# EAGLE design analog-out-and-pwr-amp (EAGLE 6.5.0)
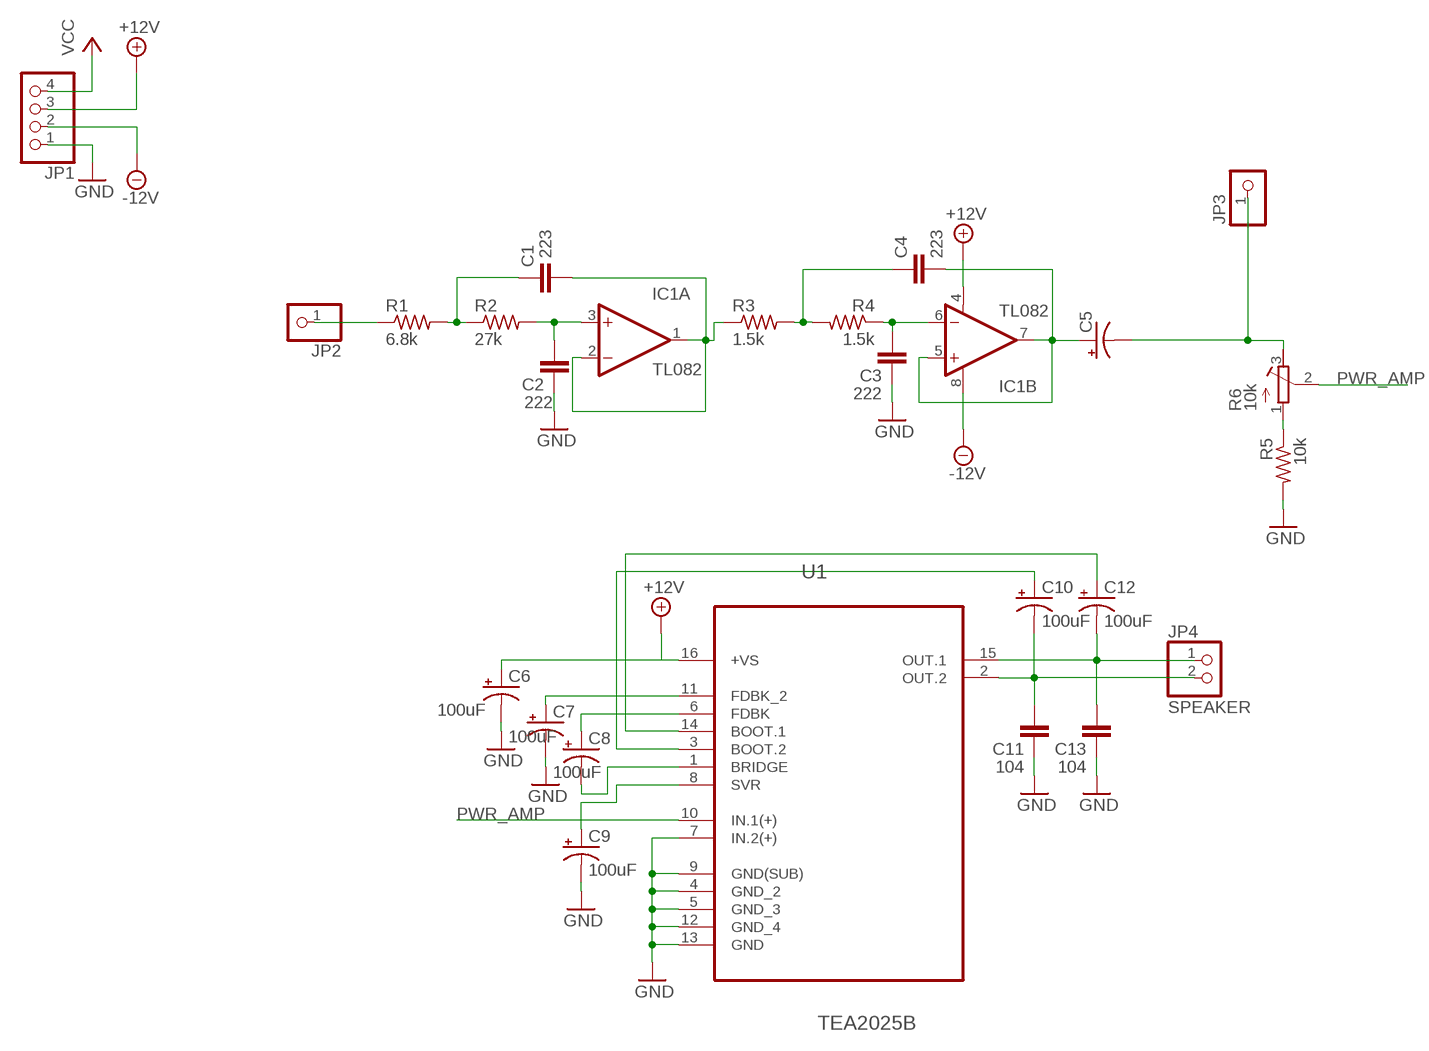
[diagram p0: schematic, sheet 1]

## Parts
C1  223  C-EUCERAMIC-CAP-COMMON  [C025-060X050]
C2  222  C-EUCERAMIC-CAP-COMMON  [C025-060X050]
C3  222  C-EUCERAMIC-CAP-COMMON  [C025-060X050]
C4  223  C-EUCERAMIC-CAP-COMMON  [C025-060X050]
C5  CPOL-USSANYO_D  [POL-CAP-COMMON]
C6  100uF  CPOL-USSANYO_D  [POL-CAP-COMMON]
C7  100uF  CPOL-USSANYO_D  [POL-CAP-COMMON]
C8  100uF  CPOL-USSANYO_D  [POL-CAP-COMMON]
C9  100uF  CPOL-USSANYO_D  [POL-CAP-COMMON]
C10  100uF  CPOL-USSANYO_D  [POL-CAP-COMMON]
C11  104  C-EUCERAMIC-CAP-COMMON  [C025-060X050]
C12  100uF  CPOL-USSANYO_D  [POL-CAP-COMMON]
C13  104  C-EUCERAMIC-CAP-COMMON  [C025-060X050]
IC1  TL082  [DIP08]
JP1  PINHD-1X4  [1X04]
JP2  PINHD-1X1  [1X01]
JP3  PINHD-1X1  [1X01]
JP4  SPEAKER  PINHD-1X20.5"  [1X02/0.5"]
R1  6.8k  R-US_0207/10  [R-US-COMMON]
R2  27k  R-US_0207/10  [R-US-COMMON]
R3  1.5k  R-US_0207/10  [R-US-COMMON]
R4  1.5k  R-US_0207/10  [R-US-COMMON]
R5  10k  R-US_0207/10  [R-US-COMMON]
R6  10k  R-TRIMM64W  [RTRIM-COMMON]
U1  TEA2025B  [DIP254P762X510-16]

## Nets
+12V: C6.+ IC1.4(B:V-) JP1.3 U1.16(+VS)
-12V: IC1.8(B:V+) JP1.2
GND: C2.1 C3.1 C6.- C7.- C9.- C11.1 C13.1 JP1.1 R5.2 U1.4(GND_2) U1.5(GND_3) U1.7(IN.2(+)) U1.9(GND(SUB)) U1.12(GND_4) U1.13(GND)
N$1: C4.2 C5.+ IC1.5(B:+IN) IC1.7(B:OUT)
N$2: JP2.1 R1.1
N$3: R5.1 R6.1(A)
N$4: C1.1 R1.2 R2.1
N$5: C2.2 IC1.3(A:+IN) R2.2
N$6: C1.2 IC1.1(A:OUT) IC1.2(A:-IN) R3.1
N$7: C4.1 R3.2 R4.2
N$8: C3.2 IC1.6(B:-IN) R4.1
N$9: C5.- JP3.1 R6.3(E)
N$10: C7.+ U1.11(FDBK_2)
N$11: C8.+ U1.6(FDBK)
N$12: C8.- U1.1(BRIDGE)
N$13: C12.- C13.2 JP4.1 U1.15(OUT.1)
N$14: C12.+ U1.14(BOOT.1)
N$15: C10.- C11.2 JP4.2 U1.2(OUT.2)
N$16: C10.+ U1.3(BOOT.2)
N$17: C9.+ U1.8(SVR)
PWR_AMP: R6.2(S) U1.10(IN.1(+))
VCC: JP1.4

## Library data of the parts
C1-C4 C11 C13 = datle-discrete:C-EU: CAPACITOR, European symbol
C5-C10 C12 = datle-discrete:CPOL-US: POLARIZED CAPACITOR, American symbol
IC1 = datle-analogic:TL082
JP1 = pinhead:PINHD-1X4: PIN HEADER
JP2 JP3 = datle-conn:PINHD-1X1: PIN HEADER
JP4 = datle-conn:PINHD-1X2: PIN HEADER
R1-R5 = datle-discrete:R-US_: RESISTOR, American symbol
R6 = datle-discrete:R-TRIMM: Trimm resistor
U1 = datle-analogic:TEA2025B: STREO AUDIO AMPLIFIER; MPN: TEA2025B; OC_FARNELL: 1263004; OC_NEWARK: 89K1062; PACKAGE: PDIP-16; SUPPLIER: STMICROELECTRONICS

## Board
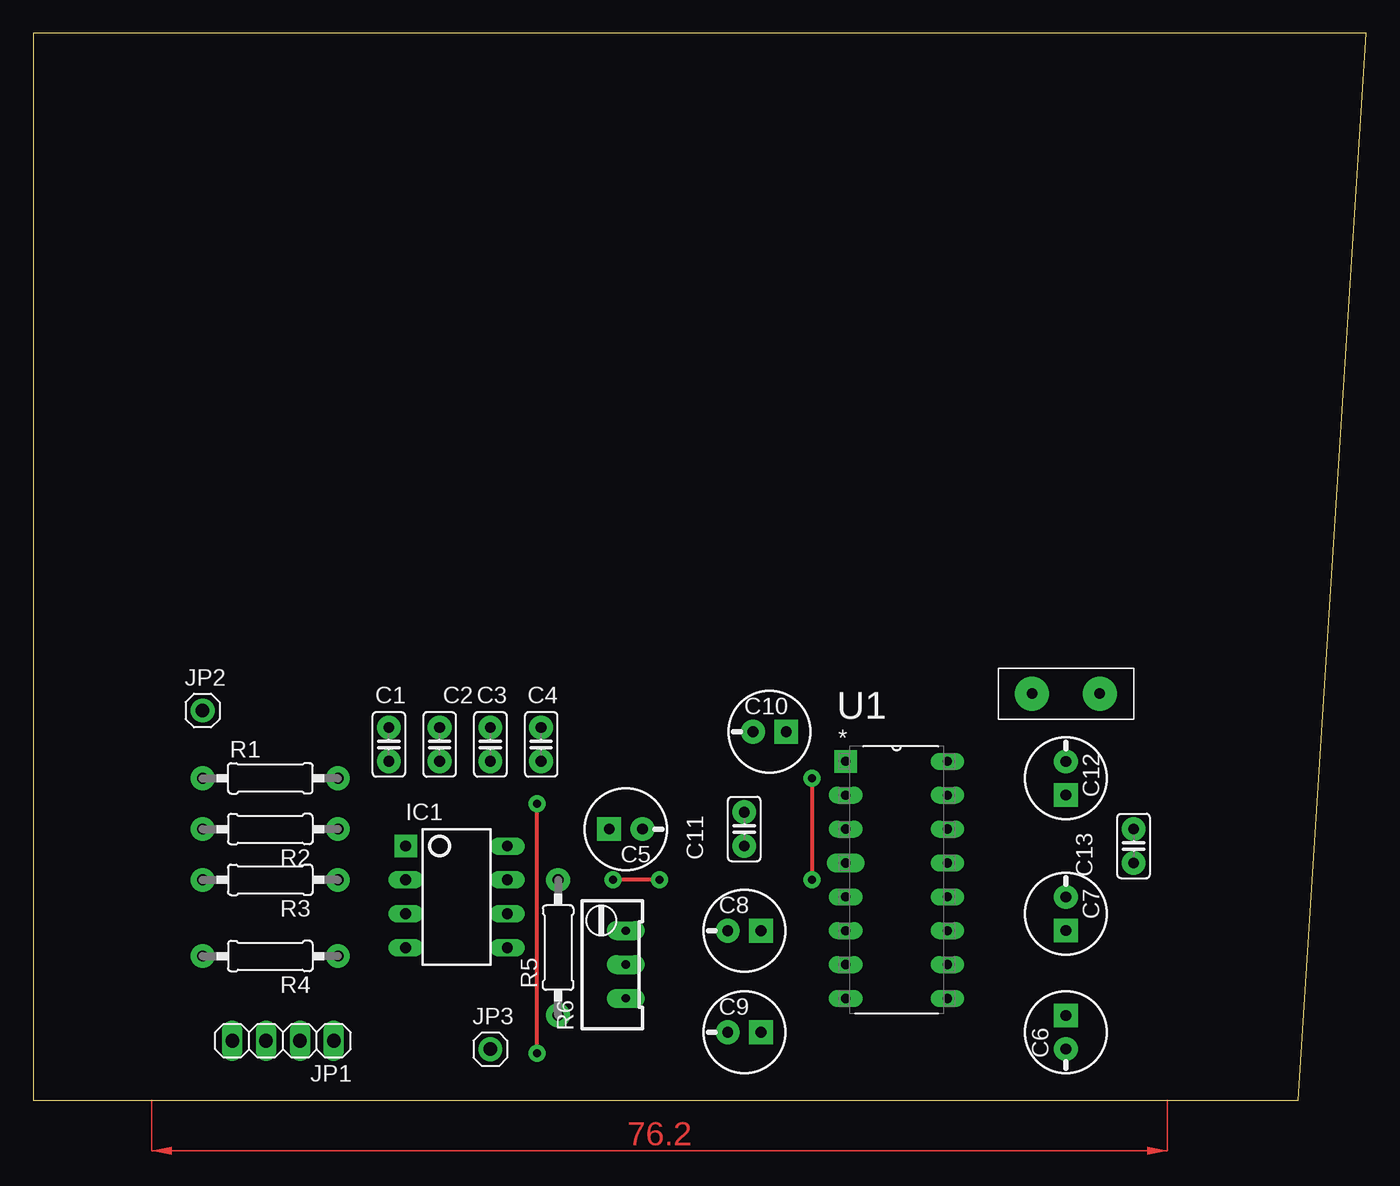
[diagram p1: board, top side]
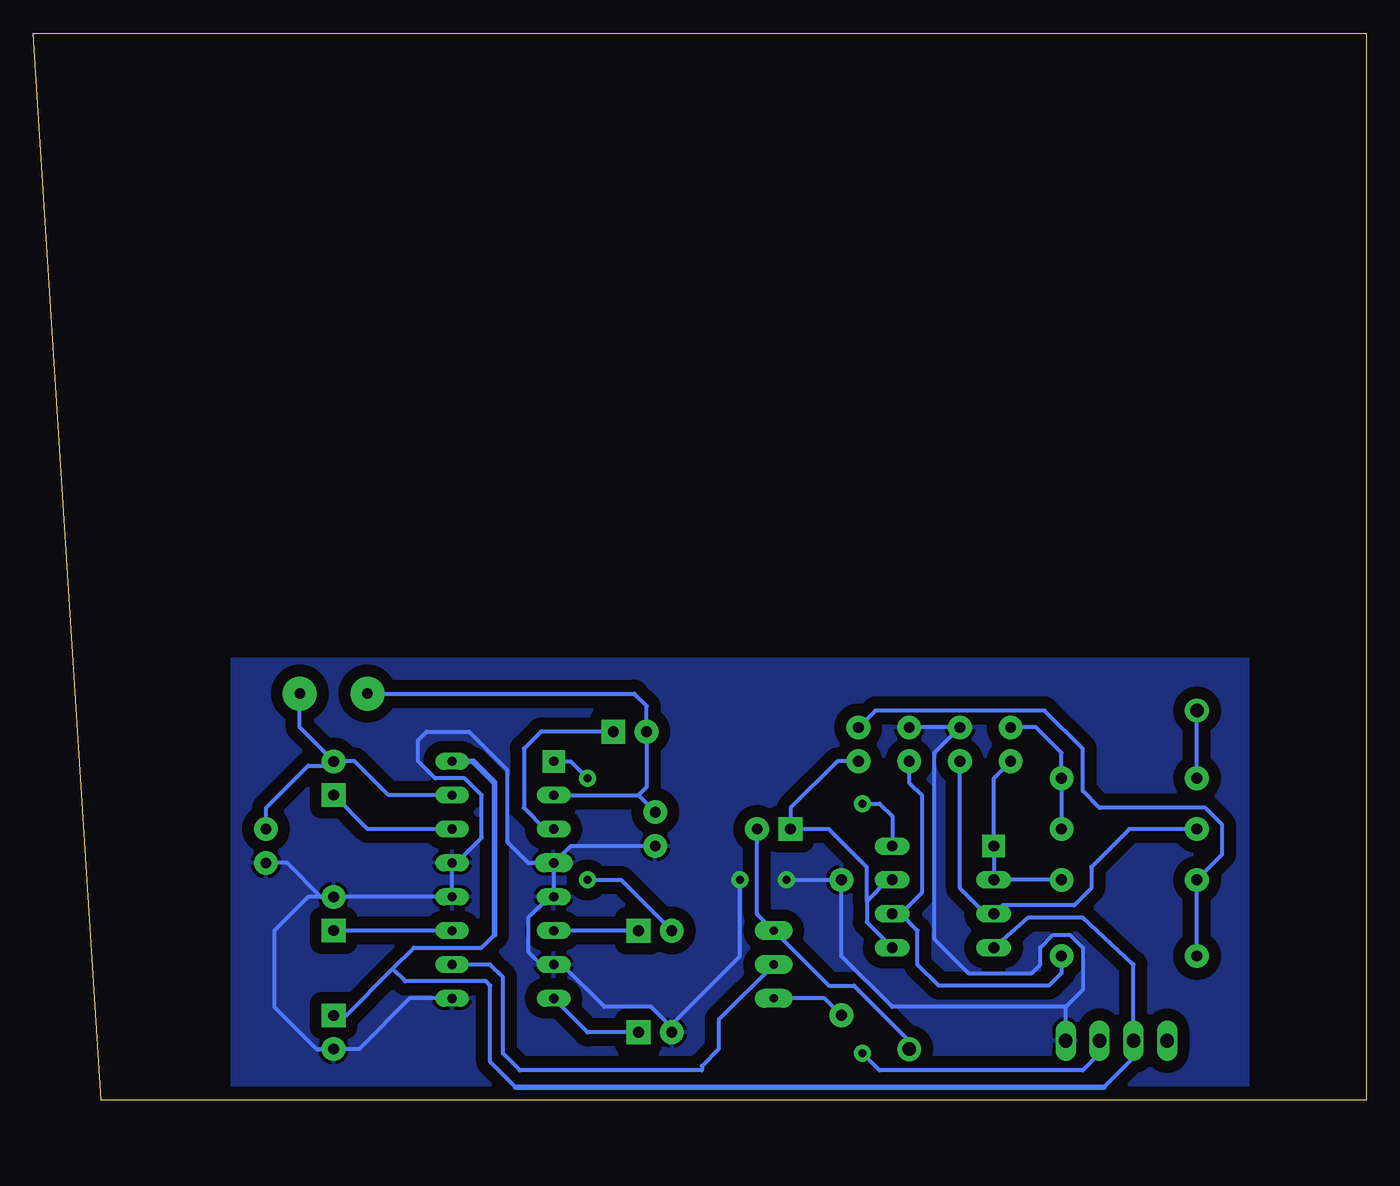
[diagram p2: board, bottom side, seen from below]

Size 100 x 80 mm. Coordinates in mm from the lower left corner, seen from the top.
Outline: 0,0 94.92,0 100,80 0,80 0,0
Copper layers (1*16): Top 0.035mm / dielectric 1.5mm / Bottom 0.035mm
Design rules "default": minimum track width 10mil, minimum drill 24mil, track to track 8mil, track to pad 8mil, pad to pad 8mil, via to via 8mil, smd to smd 8mil, copper to edge 40mil, drill to drill 8mil, minimum pad ring 10mil, minimum via ring 8mil, stop-mask expansion 4mil, vias tented up to drill 0mil, thermal gap 10mil

### Footprints (pad centres in the part's own frame; a part is rotated, then mirrored left to right if it is on the bottom)
C025-060X050 = drill 0.813 pad 1.778: 1 -1.27,0; 2 1.27,0
POL-CAP-COMMON = drill 0.8 pad 1.778 square: + 1.25,0 | drill 0.8 pad 1.778: - -1.25,0
DIP08 = drill 0.813 pad 1.676 square: 1 -3.81,-3.81 | drill 0.813 pad 1.27 long: 2 -1.27,-3.81; 3 1.27,-3.81; 4 3.81,-3.81; 5 3.81,3.81; 6 1.27,3.81; 7 -1.27,3.81; 8 -3.81,3.81
1X04 = drill 1.016 long: 1 -3.81,0; 2 -1.27,0; 3 1.27,0; 4 3.81,0
1X01 = drill 1.016 pad 1.778: 1 0,0
1X02/0.5" = drill 0.8 pad 2.54: 1 -3.81,0; 2 1.27,0
R-US-COMMON = drill 0.813 pad 1.778: 1 -5.08,0; 2 5.08,0
RTRIM-COMMON = drill 0.61 pad 1.422 long: 1 1.27,-2.54; 2 1.27,0; 3 1.27,2.54
DIP254P762X510-16 = drill 0.7 pad 1.676 square: 1 -7.62,17.78 | drill 0.7 pad 1.27 long: 2 -7.62,15.24; 3 -7.62,12.7; 5 -7.62,7.62; 6 -7.62,5.08; 7 -7.62,2.54; 8 -7.62,0; 9 0,0; 10 0,2.54; 11 0,5.08; 12 0,7.62; 13 0,10.16; 14 0,12.7; 15 0,15.24; 16 0,17.78 | drill 0.7 pad 1.422 long: 4 -7.62,10.16

### Placement (x,y rotation side)
C1  26.67,26.67 270 top
C2  30.48,26.67 270 top
C3  34.29,26.67 270 top
C4  38.1,26.67 270 top
C5  44.45,20.32 180 top
C6  77.47,5.08 90 top
C7  77.47,13.97 270 top
C8  53.34,12.7 0 top
C9  53.34,5.08 0 top
C10  55.24,27.62 0 top
C11  53.34,20.32 90 top
C12  77.47,24.13 270 top
C13  82.55,19.05 90 top
IC1  31.75,15.24 270 top
JP1  18.73,4.45 180 top
JP2  12.7,29.21 0 top
JP3  34.29,3.81 0 top
JP4  76.2,30.48 180 top
R1  17.78,24.13 0 top
R2  17.78,20.32 180 top
R3  17.78,16.51 180 top
R4  17.78,10.79 180 top
R5  39.37,11.43 90 top
R6  43.18,10.16 0 top
U1  68.58,7.62 0 top

### Tracks (layer width: path | path; a pad name or v marks a point on that pad's centre or on a via)
+12V
  Bottom 0.305: C6.+ 76.54,6.33 73.03,9.84 | 73.03,9.84 71.44,11.43 66.36,11.43 65.41,12.38 | 19.68,0.95 17.46,3.17 JP1.3 17.46,10.16 21.27,13.65 25.4,13.65 IC1.4 | 63.82,0.95 65.72,2.86 65.72,8.57 66.04,8.89 72.07,8.89 73.03,9.84
  Bottom 0.406: 65.41,12.38 65.41,23.81 66.99,25.4 U1.16 | 19.68,0.95 63.82,0.95
-12V  (via drill 0.6 pad 1.27)
  Top 0.305: v37.78,3.49 v37.78,22.23
  Bottom 0.305: JP1.2 20,3.49 21.27,2.22 36.51,2.22 v37.78,3.49 | v37.78,22.23 36.51,22.23 35.56,21.27 IC1.8
GND  (via drill 0.6 pad 1.27)
  Top 0.305: v46.99,16.51 v43.5,16.51
  Bottom 0.305: C3.1 C2.1 32.38,26.04 32.38,12.06 29.84,9.53 25.08,9.53 24.45,10.16 24.45,11.43 23.5,12.38 22.23,12.38 21.27,11.43 21.27,8.26 22.54,6.99 | C9.- 52.09,5.42 | 52.09,5.42 53.66,6.99 57.15,6.99 60.33,10.16 U1.7 61.91,10.16 62.87,11.11 62.87,13.65 61.28,15.24 U1.5 U1.4 | 52.09,5.42 52.09,5.7 46.99,10.79 v46.99,16.51 | C11.1 59.69,19.05 U1.4 | U1.12 U1.13 | U1.9 71.75,7.62 75.56,3.81 77.45,3.81 C6.- 77.49,3.81 78.74,3.81 81.92,6.99 81.92,12.7 79.38,15.24 U1.12 | U1.12 77.45,15.24 C7.- 78.4,15.22 80.96,17.78 C13.1 | U1.12 68.58,17.46 66.36,19.68 66.36,22.86 67.63,24.13 69.85,24.13 71.12,25.4 71.12,26.99 70.48,27.62 67.31,27.62 64.45,24.77 64.45,19.37 62.87,17.78 U1.4 | 22.54,6.99 35.56,6.99 39.37,10.79 R5.2 v43.5,16.51 | JP1.1 22.54,6.99
  pour Bottom (isolate 0.889): 8.89,0 8.89,33.02 85.09,33.02 85.09,0
N$1
  Bottom 0.305: IC1.7 35.88,16.51 37.47,14.92 | 37.47,14.92 37.47,13.34 IC1.5 | 37.47,14.92 37.47,17.46 40.32,20.32 C5.+ 43.18,20.34 43.18,21.91 39.69,25.4 C4.2
N$2
  Bottom 0.305: R1.1 JP2.1
N$3
  Bottom 0.305: R5.1 40.64,7.62 R6.1
N$4
  Bottom 0.305: R2.1 R1.2 22.86,26.04 24.77,27.94 C1.1
N$5
  Bottom 0.305: R2.2 17.78,20.32 20.64,17.46 20.64,15.88 21.91,14.61 27.3,14.61 IC1.3 28.57,13.97 30.48,15.88 C2.2
N$6
  Bottom 0.305: R3.1 IC1.2 IC1.1 27.94,24.13 C1.2
N$7
  Bottom 0.305: R4.2 R3.2 10.79,18.41 10.79,20.64 12.06,21.91 20,21.91 21.27,23.18 21.27,26.35 24.13,29.21 36.83,29.21 C4.1
N$8
  Bottom 0.305: C3.2 34.29,23.81 33.34,22.86 33.34,15.56 34.92,13.97 | 34.92,13.97 IC1.6 | R4.1 22.86,9.53 23.81,8.57 32.07,8.57 33.66,10.16 33.66,12.7 34.92,13.97
N$9
  Bottom 0.305: 45.7,19.35 C5.- 45.7,13.95 R6.3 40.32,8.57 38.42,8.57 34.29,4.45 JP3.1
N$10
  Bottom 0.305: U1.11 77.45,12.7 C7.+
N$11
  Bottom 0.305: C8.+ U1.6
N$12  (via drill 0.6 pad 1.27)
  Top 0.305: v58.42,24.13 v58.42,16.51
  Bottom 0.305: U1.1 59.69,25.4 v58.42,24.13 | v58.42,16.51 55.9,16.51 C8.-
N$13
  Bottom 0.305: U1.15 73.34,22.86 75.88,25.4 77.45,25.4 C12.- | C12.- 77.47,25.4 80.01,27.94 JP4.1 | C13.2 82.55,21.91 79.38,25.08 77.77,25.08 C12.-
N$14
  Bottom 0.305: U1.14 74.91,20.32 C12.+
N$15
  Bottom 0.305: U1.2 54.61,22.86 | 54.61,22.86 C11.2 | 54.61,22.86 53.99,23.48 C10.- 53.99,29.51 53.98,29.53 54.93,30.48 JP4.2
N$16
  Bottom 0.305: C10.+ 61.91,27.62 63.18,26.35 63.18,21.91 61.59,20.32 U1.3
N$17
  Bottom 0.305: C9.+ 58.42,5.08 U1.8
PWR_AMP
  Bottom 0.305: U1.10 65.72,10.16 64.77,9.21 64.77,3.49 63.5,2.22 49.85,2.22 49.85,2.54 48.58,3.81 48.58,6.03 R6.2
(copper drawn outside any net)
  shapes: Top area x1